# EAGLE schematic Soriano.Isabella_USER.OS (EAGLE 9.6.2)
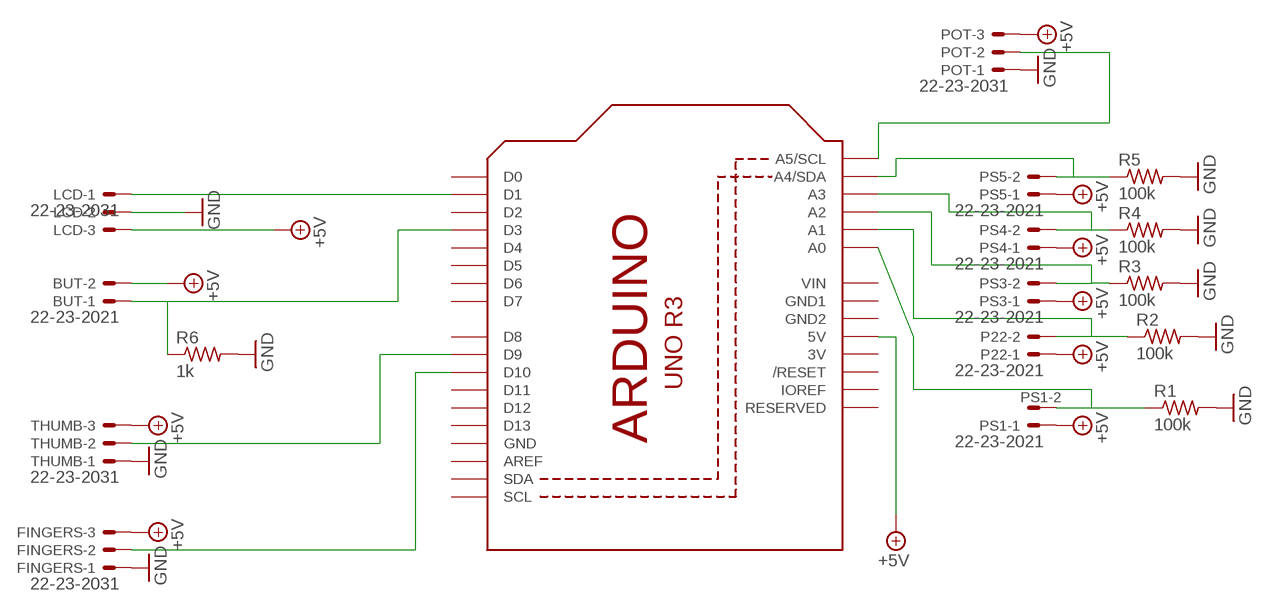
[diagram p0: schematic, sheet 1]

## Parts
BUT  22-23-2021  [22-23-2021]
FINGERS  22-23-2031  [22-23-2031]
LCD  22-23-2031  [22-23-2031]
P22  22-23-2021  [22-23-2021]
POT  22-23-2031  [22-23-2031]
PS1  22-23-2021  [22-23-2021]
PS3  22-23-2021  [22-23-2021]
PS4  22-23-2021  [22-23-2021]
PS5  22-23-2021  [22-23-2021]
R1  100k  R-US_R0805  [R0805]
R2  100k  R-US_R0805  [R0805]
R3  100k  R-US_R0805  [R0805]
R4  100k  R-US_R0805  [R0805]
R5  100k  R-US_R0805  [R0805]
R6  1k  R-US_R0805  [R0805]
THUMB  22-23-2031  [22-23-2031]
U1  ARDUINOR3-BPLACE  [ARDUINOR3-BPLACE]

## Nets
+5V: BUT.2 FINGERS.3 LCD.3 P22.1 POT.3 PS1.1 PS3.1 PS4.1 PS5.1 THUMB.3 U1.5V
GND: FINGERS.1 LCD.2 POT.1 R1.2 R2.2 R3.2 R4.2 R5.2 R6.2 THUMB.1
N$1: PS1.2 R1.1 U1.A0
N$2: P22.2 R2.1 U1.A1
N$3: PS3.2 R3.1 U1.A2
N$4: PS4.2 R4.1 U1.A3
N$5: LCD.1 U1.D1
N$6: PS5.2 R5.1 U1.A4(A4/SDA)
N$7: BUT.1 R6.1 U1.D3
N$8: POT.2 U1.A5(A5/SCL)
N$9: THUMB.2 U1.D9
N$10: FINGERS.2 U1.D10
Unconnected: U1.AREF U1.D0 U1.D2 U1.D4 U1.D5 U1.D6 U1.D7 U1.D8 U1.D11 U1.D12 U1.D13 U1.IOREF U1.RESERVED U1.RESET(/RESET) U1.SCL U1.SDA

## Power pins joined to a net without a drawn wire
3V: U1.3V
GND: U1.GND
GND1: U1.GND1
GND2: U1.GND2
VIN: U1.VIN

## Library data of the parts
BUT P22 PS1 PS3-PS5 = con-molex:22-23-2021: .100" (2.54mm) Center Header - 2 Pin; MF: MOLEX; MPN: 22-23-2021; OC_FARNELL: 1462926; OC_NEWARK: 25C3832
FINGERS LCD POT THUMB = con-molex:22-23-2031: .100" (2.54mm) Center Header - 3 Pin; MF: MOLEX; MPN: 22-23-2031; OC_FARNELL: 1462950; OC_NEWARK: 30C0862
R1-R6 = resistor:R-US_: RESISTOR, American symbol
U1 = adafruit:ARDUINOR3: This is a new object for the new Arduino R3 - with extra pins that you may want to use (such as IOref, and duplicated A4/A5